# EAGLE design Next_Make_CPW_2015_Prototype (EAGLE 7.0.0)
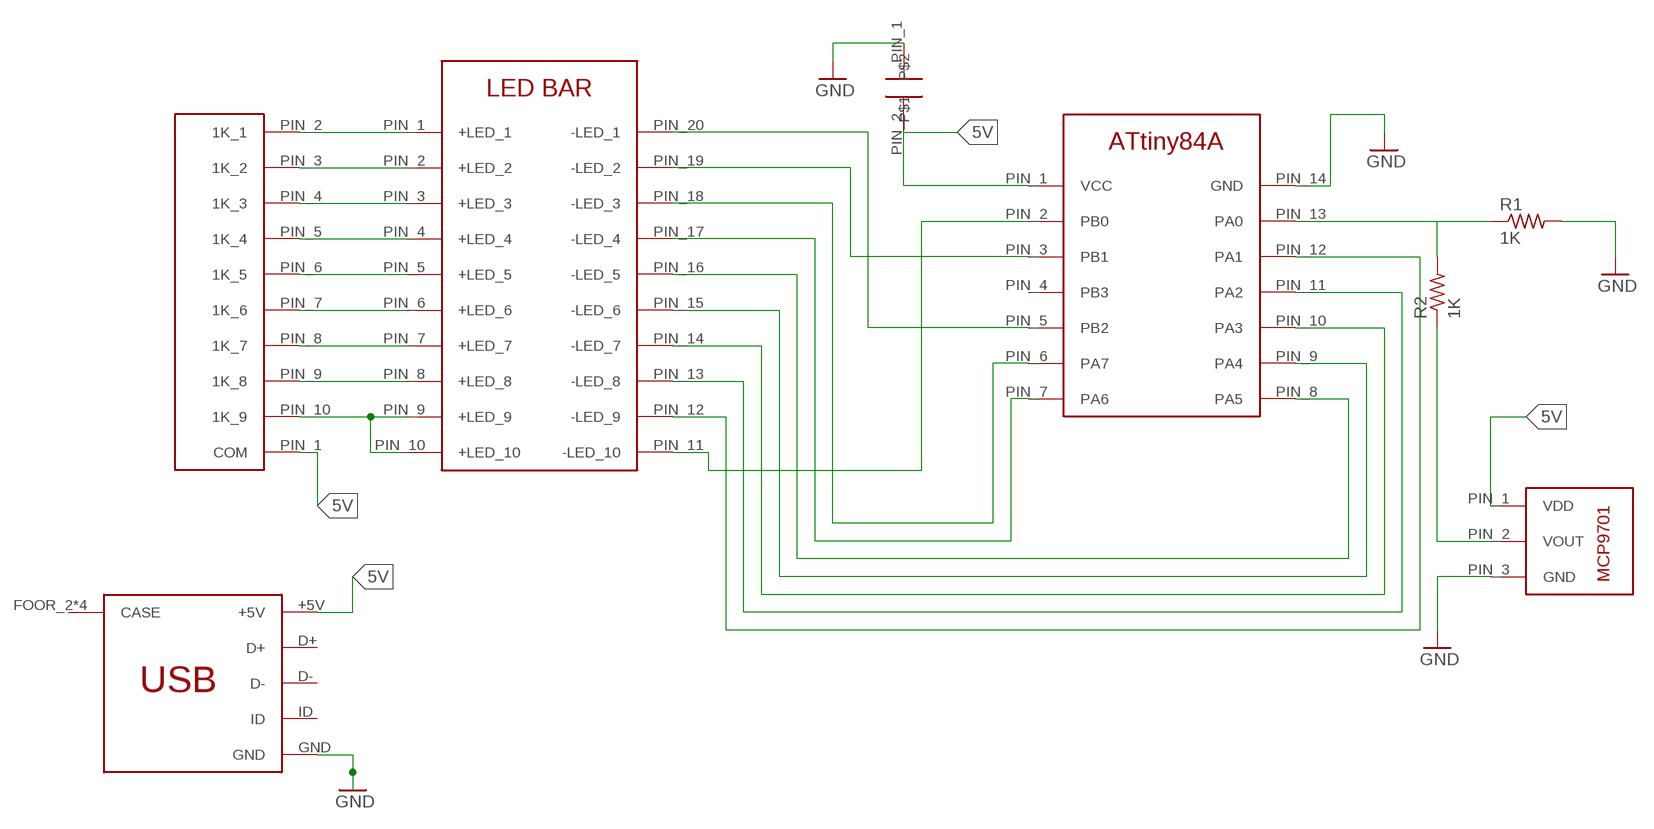
[diagram p0: schematic, sheet 1]

## Parts
R1  1K  R-US_M1206  [M1206]
R2  1K  R-US_M1206  [M1206]
U$1  9X_1K_BUSSED_R  [SIP-10]
U$2  10UF_FK18  [CAP_FK18]
U$3  ATTINY84A  [PDIP-14]
U$4  LED_X10_BAR  [LED_X10_BAR]
U$5  MCP9701  [TO-92-3]
U$6  USB_MINI  [SMT_MINI_USB]

## Nets
5V: U$1.PIN_1(COM) U$2.PIN_2 U$3.PIN_1(VCC) U$5.PIN_1(VDD) U$6.+5V
GND: R1.2 U$2.PIN_1 U$3.PIN_14(GND) U$5.PIN_3(GND) U$6.GND
N$1: U$1.PIN_2(1K_1) U$4.PIN_1(+LED_1)
N$2: U$1.PIN_3(1K_2) U$4.PIN_2(+LED_2)
N$3: U$1.PIN_4(1K_3) U$4.PIN_3(+LED_3)
N$4: U$1.PIN_5(1K_4) U$4.PIN_4(+LED_4)
N$5: U$1.PIN_6(1K_5) U$4.PIN_5(+LED_5)
N$6: U$1.PIN_7(1K_6) U$4.PIN_6(+LED_6)
N$7: U$1.PIN_8(1K_7) U$4.PIN_7(+LED_7)
N$8: U$1.PIN_9(1K_8) U$4.PIN_8(+LED_8)
N$9: R2.1 U$5.PIN_2(VOUT)
N$10: R1.1 R2.2 U$3.PIN_13(PA0)
N$11: U$3.PIN_11(PA2) U$4.PIN_13(-LED_8)
N$12: U$3.PIN_12(PA1) U$4.PIN_12(-LED_9)
N$13: U$3.PIN_10(PA3) U$4.PIN_14(-LED_7)
N$14: U$3.PIN_9(PA4) U$4.PIN_15(-LED_6)
N$15: U$3.PIN_8(PA5) U$4.PIN_16(-LED_5)
N$16: U$3.PIN_7(PA6) U$4.PIN_17(-LED_4)
N$17: U$3.PIN_6(PA7) U$4.PIN_18(-LED_3)
N$18: U$3.PIN_3(PB1) U$4.PIN_19(-LED_2)
N$19: U$3.PIN_5(PB2) U$4.PIN_20(-LED_1)
N$20: U$1.PIN_10(1K_9) U$4.PIN_9(+LED_9) U$4.PIN_10(+LED_10)
N$21: U$3.PIN_2(PB0) U$4.PIN_11(-LED_10)
Unconnected: U$3.PIN_4(PB3) U$6.D+ U$6.D- U$6.FOOR_2(CASE) U$6.FOOT_1(CASE) U$6.FOOT_3(CASE) U$6.FOOT_4(CASE) U$6.ID

## Library data of the parts
R1 R2 = rcl:R-US_: RESISTOR, American symbol
U$1 = Next_Make_CPW_2015:9X_1K_BUSSED_R
U$2 = Next_Make_CPW_2015:10UF_FK18
U$3 = Next_Make_CPW_2015:ATTINY84A
U$4 = Next_Make_CPW_2015:LED_X10_BAR
U$5 = Next_Make_CPW_2015:MCP9701
U$6 = Next_Make_CPW_2015:USB_MINI

## Board
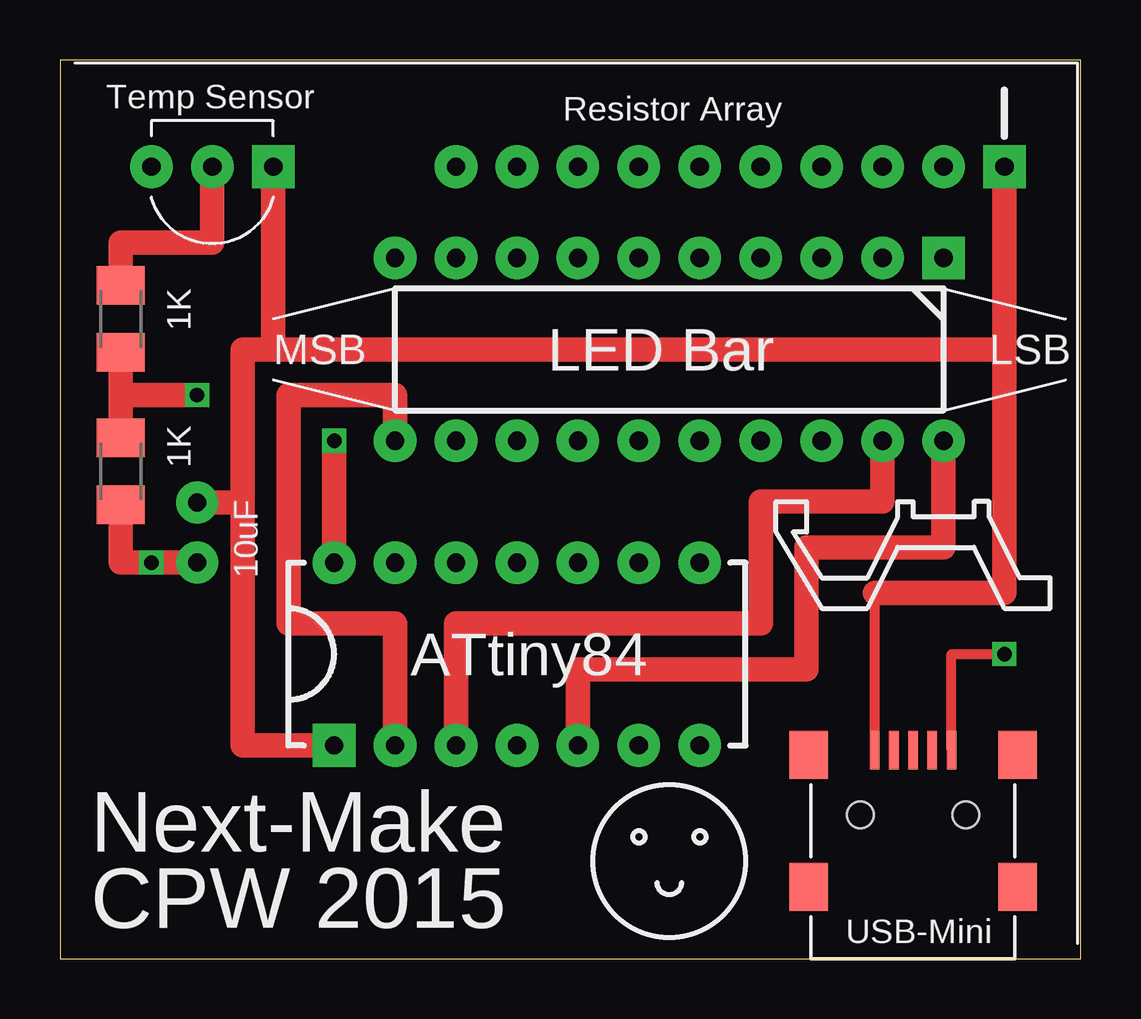
[diagram p1: board, top side]
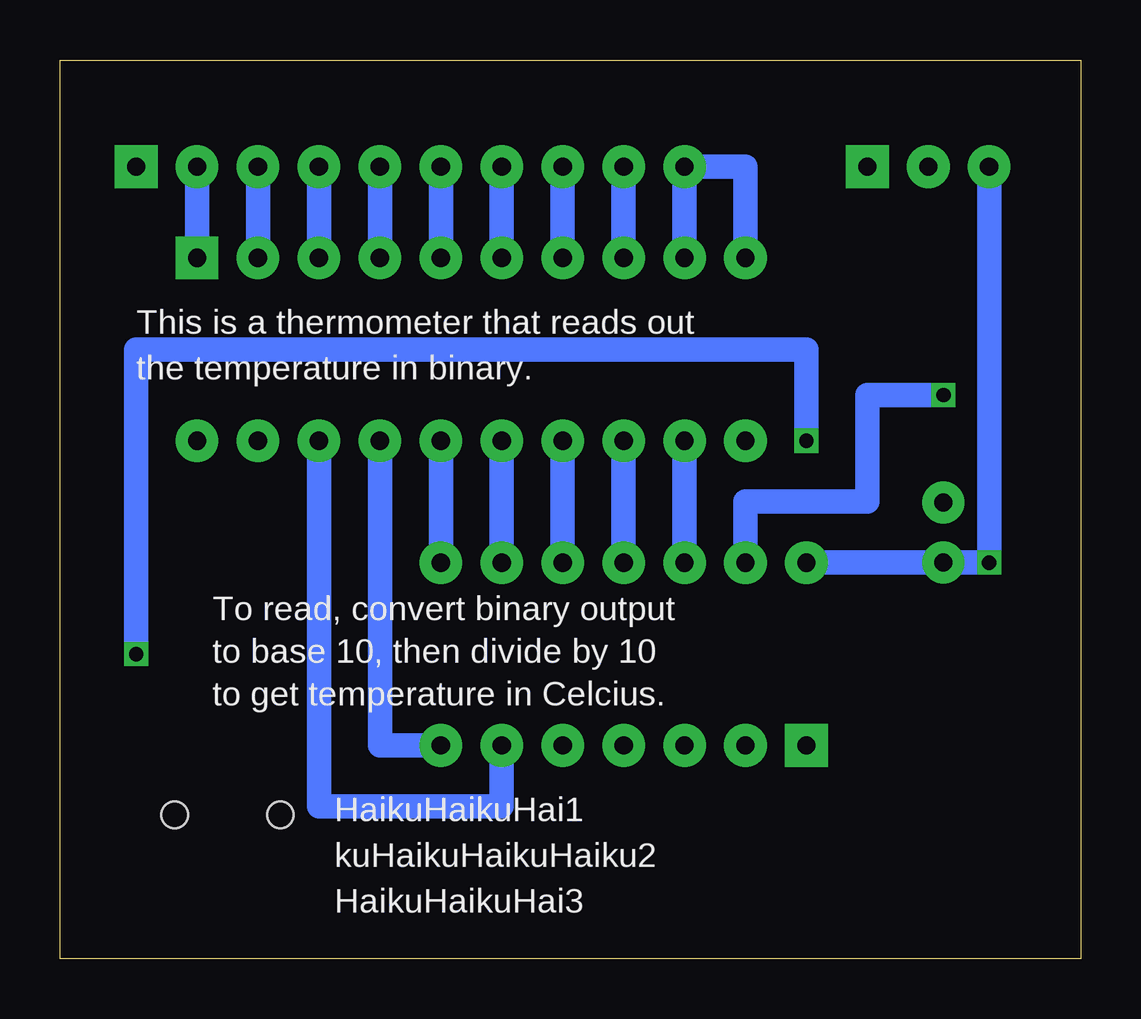
[diagram p2: board, bottom side, seen from below]

Size 42.55 x 37.47 mm. Coordinates in mm from the lower left corner, seen from the top.
Outline: 42.55,37.47 0,37.47 0,0 42.55,0 42.55,37.47
Copper layers (1*16): Top 0.035mm / dielectric 1.5mm / Bottom 0.035mm
Design rules "default *": minimum track width 10mil, minimum drill 24mil, track to track 8mil, track to pad 8mil, pad to pad 8mil, via to via 8mil, smd to smd 8mil, copper to edge 40mil, drill to drill 8mil, minimum pad ring 10mil, minimum via ring 8mil, stop-mask expansion 4mil, vias tented up to drill 25mil, thermal gap 10mil

### Footprints (pad centres in the part's own frame; a part is rotated, then mirrored left to right if it is on the bottom)
M1206 = smd 1.6 x 2: 1 -1.4,0; 2 1.4,0
SIP-10 = drill 0.762 pad 1.778 square: PIN_1 0,0 | drill 0.762 pad 1.778: PIN_2 0,-2.54; PIN_3 0,-5.08; PIN_4 0,-7.62; PIN_5 0,-10.16; PIN_6 0,-12.7; PIN_7 0,-15.24; PIN_8 0,-17.78; PIN_9 0,-20.32; PIN_10 0,-22.86
CAP_FK18 = drill 0.75 pad 1.75: PIN_1 0,0; PIN_2 2.5,0
PDIP-14 = drill 0.762 pad 1.778 square: PIN_1 0,15.24 | drill 0.762 pad 1.778: PIN_2 0,12.7; PIN_3 0,10.16; PIN_4 0,7.62; PIN_5 0,5.08; PIN_6 0,2.54; PIN_7 0,0; PIN_8 7.62,0; PIN_9 7.62,2.54; PIN_10 7.62,5.08; PIN_11 7.62,7.62; PIN_12 7.62,10.16; PIN_13 7.62,12.7; PIN_14 7.62,15.24
LED_X10_BAR = drill 0.762 pad 1.778 square: PIN_1 0,0 | drill 0.762 pad 1.778: PIN_2 0,-2.54; PIN_3 0,-5.08; PIN_4 0,-7.62; PIN_5 0,-10.16; PIN_6 0,-12.7; PIN_7 0,-15.24; PIN_8 0,-17.78; PIN_9 0,-20.32; PIN_10 0,-22.86; PIN_11 7.62,-22.86; PIN_12 7.62,-20.32; PIN_13 7.62,-17.78; PIN_14 7.62,-15.24; PIN_15 7.62,-12.7; PIN_16 7.62,-10.16; PIN_17 7.62,-7.62; PIN_18 7.62,-5.08; PIN_19 7.62,-2.54; PIN_20 7.62,0
TO-92-3 = drill 0.762 pad 1.778 square: PIN_1 0,0 | drill 0.762 pad 1.778: PIN_2 2.54,0; PIN_3 5.08,0
SMT_MINI_USB = smd 1.6 x 0.4: +5V 8.7,1.6; D+ 8.7,0; D- 8.7,0.8; GND 8.7,-1.6; ID 8.7,-0.8 | smd 2 x 1.6: FOOR_2 8.5,-4.35; FOOT_1 3,-4.35; FOOT_3 8.5,4.35; FOOT_4 3,4.35 | hole 1.1: 6,-2.2; 6,2.2

### Placement (x,y rotation side)
R1  2.54,20.32 270 top
R2  2.54,26.67 270 top
U$1  39.37,33.02 270 top
U$2  5.71,16.51 90 top
U$3  26.67,8.89 90 top
U$4  36.83,29.21 270 top
U$5  8.89,33.02 180 top
U$6  35.56,0 90 top

### Tracks (layer width: path | path; a pad name or v marks a point on that pad's centre or on a via)
5V
  Top 0.406: U$6.+5V 33.96,15.24
  Top 1.016: 33.96,15.24 39.37,15.24 39.37,25.4 | 39.37,25.4 U$1.PIN_1 | U$3.PIN_1 7.62,8.89 7.62,19.01 | 7.62,19.01 7.62,25.4 8.89,25.4 | 8.89,25.4 39.37,25.4 | U$2.PIN_2 7.62,19.01 | U$5.PIN_1 8.89,25.4
GND  (via drill 0.6)
  Top 0.406: U$6.GND 37.16,12.7 v39.37,12.7
  Top 1.016: v11.43,21.59 U$3.PIN_14 | R1.2 2.54,16.51 v3.81,16.51 U$2.PIN_1
  Bottom 1.016: v39.37,12.7 39.37,25.4 11.43,25.4 v11.43,21.59 | U$3.PIN_14 U$2.PIN_1 v3.81,16.51 U$5.PIN_3
N$1
  Bottom 1.016: U$4.PIN_1 U$1.PIN_2
N$2
  Bottom 1.016: U$4.PIN_2 U$1.PIN_3
N$3
  Bottom 1.016: U$4.PIN_3 U$1.PIN_4
N$4
  Bottom 1.016: U$4.PIN_4 U$1.PIN_5
N$5
  Bottom 1.016: U$4.PIN_5 U$1.PIN_6
N$6
  Bottom 1.016: U$4.PIN_6 U$1.PIN_7
N$7
  Bottom 1.016: U$4.PIN_7 U$1.PIN_8
N$8
  Bottom 1.016: U$4.PIN_8 U$1.PIN_9
N$9
  Top 1.016: U$5.PIN_2 6.35,29.84 2.54,29.84 R2.1
N$10  (via drill 0.6)
  Top 1.016: R1.1 2.54,23.5 | 2.54,23.5 R2.2 | v5.71,23.5 2.54,23.5
  Bottom 1.016: U$3.PIN_13 13.97,19.05 8.89,19.05 8.89,23.5 v5.71,23.5
N$11
  Bottom 1.016: U$3.PIN_11 U$4.PIN_13
N$12
  Bottom 1.016: U$3.PIN_12 U$4.PIN_12
N$13
  Bottom 1.016: U$3.PIN_10 U$4.PIN_14
N$14
  Bottom 1.016: U$3.PIN_9 U$4.PIN_15
N$15
  Bottom 1.016: U$3.PIN_8 U$4.PIN_16
N$16
  Bottom 1.016: U$3.PIN_7 29.21,8.89 U$4.PIN_17
N$17
  Bottom 1.016: U$3.PIN_6 24.13,6.35 31.75,6.35 U$4.PIN_18
N$18
  Top 1.016: U$3.PIN_3 16.51,13.97 29.21,13.97 29.21,19.05 34.29,19.05 U$4.PIN_19
N$19
  Top 1.016: U$3.PIN_5 21.59,12.06 31.11,12.06 31.11,17.14 36.83,17.14 U$4.PIN_20
N$20
  Bottom 1.016: U$4.PIN_9 U$1.PIN_10 13.97,33.02 U$4.PIN_10
N$21
  Top 1.016: U$4.PIN_11 13.97,23.5 9.53,23.5 9.53,13.97 13.97,13.97 U$3.PIN_2

### Text on the board
tPlace: Temp Sensor | MSB | LED Bar | LSB | ATtiny84 | Next-Make | CPW 2015
bPlace: HaikuHaikuHai1 | kuHaikuHaikuHaiku2 | HaikuHaikuHai3
tNames: Resistor Array | 10uF
bNames: This is a thermometer that reads out | the temperature in binary. | To read, convert binary output | to base 10, then divide by 10 | to get temperature in Celcius.